# EAGLE design ECG_Patch (EAGLE 6.4)
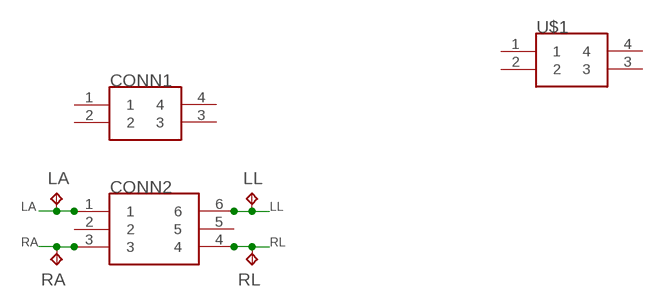
[diagram p0: schematic, sheet 1]

## Parts
CONN1  M80-4V  [M80-4-V]
CONN2  M80-6V  [M80-6-V]
LA  TPTP20R  [TP20R]
LL  TPTP20R  [TP20R]
RA  TPTP20R  [TP20R]
RL  TPTP20R  [TP20R]
U$1  M80-4SMT  [M80-4_SMT]

## Nets
LA: CONN2.1 LA.TP
LL: CONN2.6 LL.TP
RA: CONN2.3 RA.TP
RL: CONN2.4 RL.TP
Unconnected: CONN1.1 CONN1.2 CONN1.3 CONN1.4 CONN2.2 CONN2.5 U$1.1 U$1.2 U$1.3 U$1.4

## Library data of the parts
CONN1 U$1 = harwin:M80-4
CONN2 = harwin:M80-6
LA LL RA RL = testpad:TP: Test pad

## Board
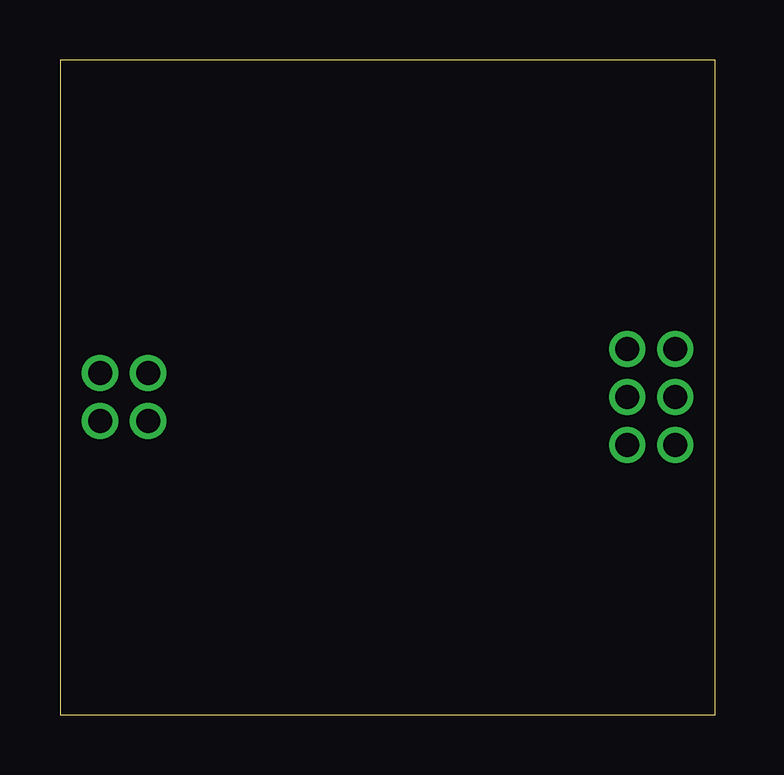
[diagram p1: board, top side]
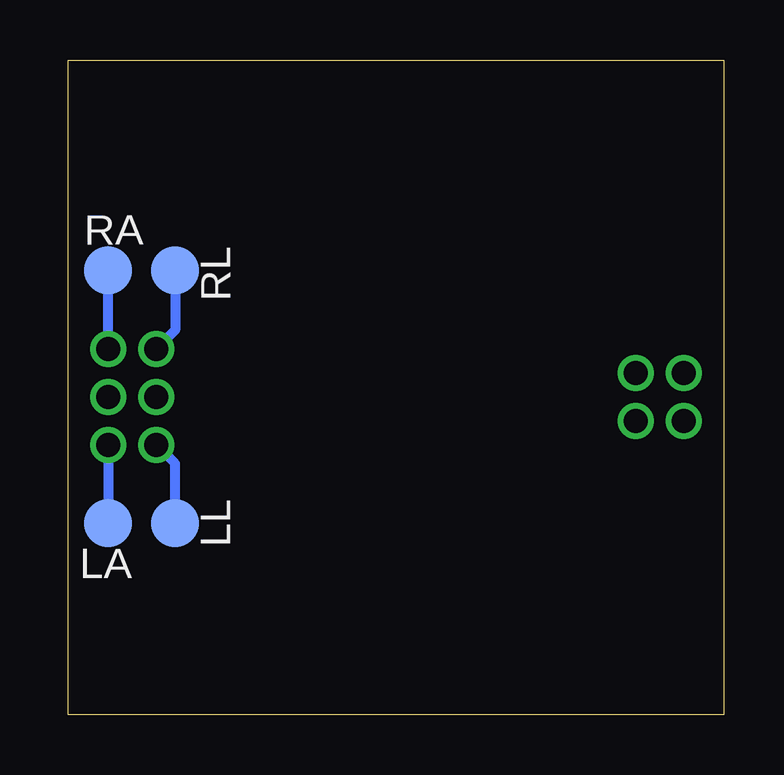
[diagram p2: board, bottom side, seen from below]

Size 27.3 x 27.3 mm. Coordinates in mm from the lower left corner, seen from the top.
Outline: 0,0 27.3,0 27.3,27.3 0,27.3 0,0
Copper layers (1*2+15*16): Top 0.035mm / dielectric 0.5mm / Route2 0.035mm / dielectric 0.5mm / Route15 0.035mm / dielectric 0.5mm / Bottom 0.035mm
Design rules "advanced_circuits *": minimum track width 7mil, minimum drill 15mil, track to track 7mil, track to pad 7mil, pad to pad 7mil, via to via 7mil, smd to smd 7mil, copper to edge 15mil, drill to drill 8mil, minimum pad ring 10mil, minimum via ring 8mil, stop-mask expansion 5mil, vias tented up to drill 0mil, thermal gap 10mil

### Footprints (pad centres in the part's own frame; a part is rotated, then mirrored left to right if it is on the bottom)
M80-4-V = drill 1: 1 -1,-1; 2 1,-1; 3 1,1; 4 -1,1
M80-6-V = drill 1: 1 -2,-1; 2 0,-1; 3 2,-1; 4 2,1; 5 0,1; 6 -2,1
TP20R = smd 2 x 2: TP 0,0

### Placement (x,y rotation side)
CONN1  2.67,13.26 0 top
CONN2  24.64,13.26 90 top
LA  25.65,8 180 bottom
LL  22.86,8 270 bottom
RA  25.65,18.54 0 bottom
RL  22.86,18.54 270 bottom

### Tracks (layer width: path | path; a pad name or v marks a point on that pad's centre or on a via)
LA
  Bottom 0.406: CONN2.1 25.64,8.02 LA.TP
LL
  Bottom 0.406: LL.TP 22.86,10.48 CONN2.6
RA
  Bottom 0.406: CONN2.3 25.64,18.53 RA.TP
RL
  Bottom 0.406: RL.TP 22.86,16.04 CONN2.4